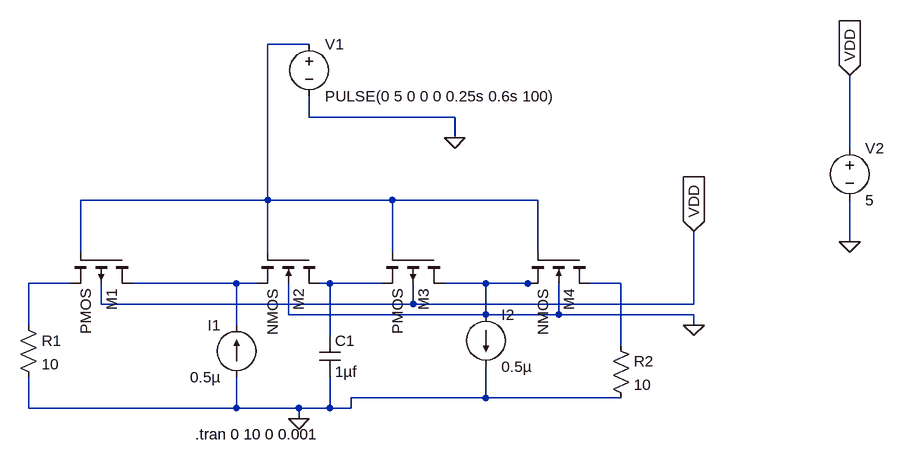
[diagram p0: schematic TriangleWave2.asc]
TriangleWave2.asc, the LTspice schematic file:
Version 4
SHEET 1 1188 752
WIRE 272 -304 208 -304
WIRE 272 -192 272 -224
WIRE 496 -192 272 -192
WIRE 496 -160 496 -192
WIRE 1104 -144 1104 -256
WIRE 208 -64 208 -304
WIRE 208 -64 -80 -64
WIRE 400 -64 208 -64
WIRE 624 -64 400 -64
WIRE 1104 0 1104 -64
WIRE -80 16 -80 -64
WIRE 208 16 208 -64
WIRE 400 16 400 -64
WIRE 624 16 624 -64
WIRE -96 64 -160 64
WIRE 160 64 0 64
WIRE 192 64 160 64
WIRE 304 64 288 64
WIRE 384 64 304 64
WIRE 544 64 480 64
WIRE 608 64 544 64
WIRE 624 64 608 64
WIRE 752 64 704 64
WIRE -48 96 -48 64
WIRE 432 96 432 64
WIRE 432 96 -48 96
WIRE 864 96 864 -16
WIRE 864 96 432 96
WIRE 240 112 240 64
WIRE 544 112 544 64
WIRE 544 112 240 112
WIRE 656 112 656 64
WIRE 656 112 544 112
WIRE 864 112 656 112
WIRE -160 128 -160 64
WIRE 160 128 160 64
WIRE 864 128 864 112
WIRE 304 144 304 64
WIRE 752 160 752 64
WIRE 544 240 544 192
WIRE 544 240 336 240
WIRE 752 240 544 240
WIRE -160 256 -160 208
WIRE 160 256 160 208
WIRE 160 256 -160 256
WIRE 256 256 160 256
WIRE 304 256 304 208
WIRE 304 256 256 256
WIRE 336 256 336 240
WIRE 336 256 304 256
WIRE 256 272 256 256
FLAG 256 272 0
FLAG 496 -160 0
FLAG 864 128 0
FLAG 1104 0 0
FLAG 1104 -256 VDD
IOPIN 1104 -256 In
FLAG 864 -16 VDD
IOPIN 864 -16 In
SYMBOL current 160 208 R180
WINDOW 0 24 80 Left 2
WINDOW 3 24 0 Left 2
WINDOW 123 0 0 Left 0
WINDOW 39 0 0 Left 0
SYMATTR InstName I1
SYMATTR Value 0.5µ
SYMBOL cap 288 144 R0
SYMATTR InstName C1
SYMATTR Value 1µf
SYMBOL res -176 112 R0
SYMATTR InstName R1
SYMATTR Value 10
SYMBOL current 544 112 R0
WINDOW 123 0 0 Left 0
WINDOW 39 0 0 Left 0
SYMATTR InstName I2
SYMATTR Value 0.5µ
SYMBOL res 736 144 R0
SYMATTR InstName R2
SYMATTR Value 10
SYMBOL voltage 272 -320 R0
WINDOW 123 0 0 Left 0
WINDOW 39 0 0 Left 0
SYMATTR InstName V1
SYMATTR Value PULSE(0 5 0 0 0 0.25s 0.6s 100)
SYMBOL pmos4 0 16 R90
SYMATTR InstName M1
SYMBOL pmos4 480 16 R90
SYMATTR InstName M3
SYMBOL nmos4 288 16 R90
SYMATTR InstName M2
SYMBOL nmos4 704 16 R90
SYMATTR InstName M4
SYMBOL voltage 1104 -160 R0
WINDOW 123 0 0 Left 0
WINDOW 39 0 0 Left 0
SYMATTR InstName V2
SYMATTR Value 5
TEXT 96 296 Left 2 !.tran 0 10 0 0.001

The netlist it stands for:
* TriangleWave2.asc
I1 0 N003 0.5µ
C1 N004 0 1µf
R1 N002 0 10
I2 0 0 0.5µ
R2 N005 0 10
V1 N001 0 PULSE(0 5 0 0 0 0.25s 0.6s 100)
M1 N003 N001 N002 VDD PMOS
M3 0 N001 N004 VDD PMOS
M2 N004 N001 N003 0 NMOS
M4 N005 N001 0 0 NMOS
V2 VDD 0 5
.model NMOS NMOS
.model PMOS PMOS
.lib standard.mos
.tran 0 10 0 0.001
.backanno
.end